# Altium project LSM303_STM32_Adapter.PrjPcb
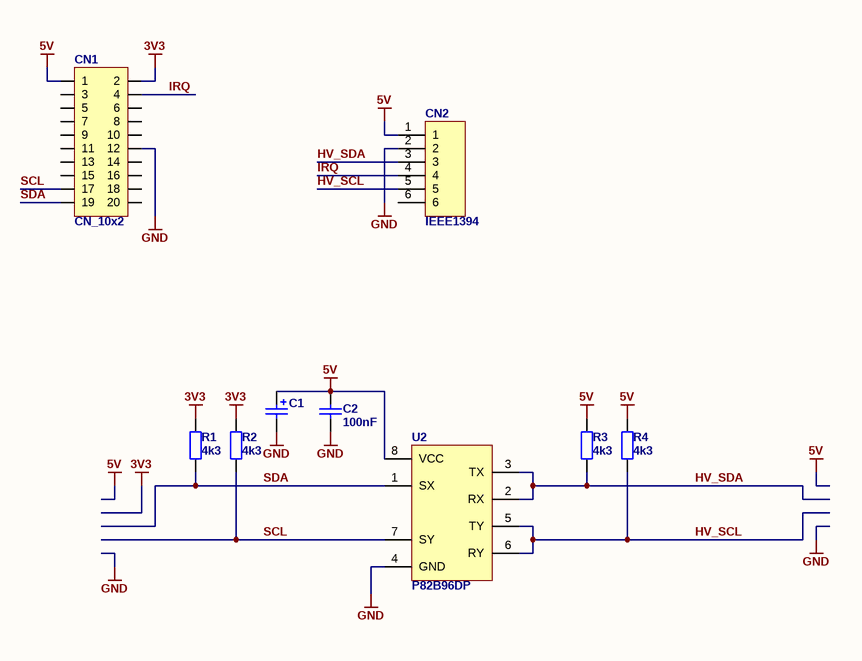
[diagram p0: sch.SchDoc]
1 sheet, 9 parts. Net scope: global (net labels, ports and power ports of the same name join across sheets).
Board file: pcb.PcbDoc

## Sheet sch.SchDoc: X
size A4; Date: DD-MM-YYYY; CheckedBy: X; DrawnBy: Y; Revision: 0.0.0; SheetNumber: X; SheetTotal: Y; Projectnumber: OWN-000; Size: A4; Projectname: X

### Parts
C1  (no value)  [SMDB]
C2  100nF  [C0603]
CN1  CN_10x2  [GP_10x2]
CN2  IEEE1394  [A-IEE-DIP-C]
R1  4k3  [R0805]
R2  4k3  [R0805]
R3  4k3  [R0603]
R4  4k3  [R0603]
U2  P82B96DP  [TSSOP8N]

### Nets
3V3: CN1.2 R1.2 R2.2
5V: C1.1 C2.2 CN1.1 CN2.1 R3.2 R4.2 U2.8(VCC)
GND: C1.2 C2.1 CN1.12 CN2.2 U2.4(GND)
HV_SCL: CN2.5 R4.1 U2.5(TY) U2.6(RY)
HV_SDA: CN2.3 R3.1 U2.2(RX) U2.3(TX)
IRQ: CN1.4 CN2.4
SCL: CN1.17 R2.1 U2.7(SY)
SDA: CN1.19 R1.1 U2.1(SX)

Not connected (* = marked no-connect by the designer): CN1 3 5 6 7 8 9 10 11 13 14 15 16 18 20; CN2 6

### Notes on the sheet
- PROJECT NAME:
- PROJECT NO.:
- DATE:
- TITLE:
- SHEET
- of
- DRAWN BY:
- REVISION:
- FILENAME:
- A4

### Library data of the parts
C1 = Cap Pol Tant: Polarized Tantalum Capacitor; ComponentLink1Description: datasheet; ComponentLink2Description: supplier
C2 = Cap: Capacitor; ComponentLink1Description: datasheet; ComponentLink2Description: supplier; Value: 100nF
R1-R4 = Res: Resistor; Published: 19-Feb-2006; ComponentLink1Description: datasheet; ComponentLink2Description: supplier; Value: 4k3
U2 = P82B96DP: Dual Bidirectional I2C Bus Buffer, TSSOP8 Package